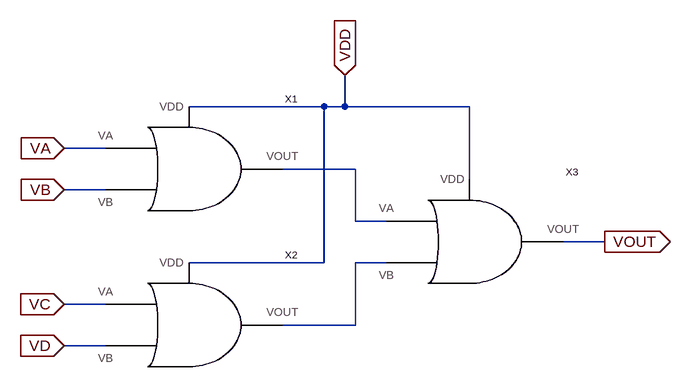
[diagram p0: schematic or4.asc]
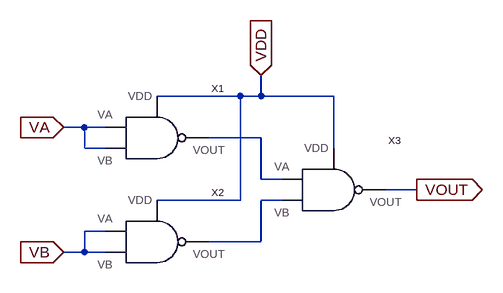
[diagram p1: sub-circuit or.asc]
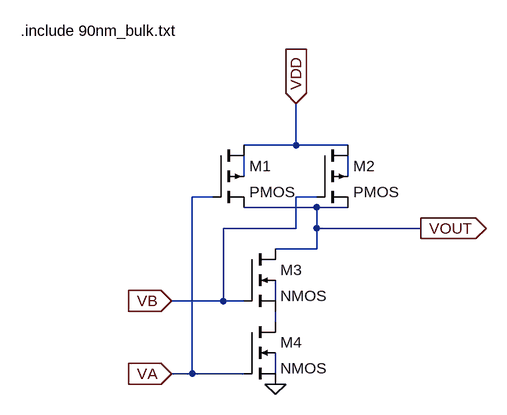
[diagram p2: sub-circuit nand.asc]
or4.asc, the LTspice schematic file:
Version 4
SHEET 1 1196 680
WIRE 320 -112 112 -112
WIRE 352 -112 352 -160
WIRE 352 -112 320 -112
WIRE 544 -112 352 -112
WIRE -16 -48 -80 -48
WIRE 368 -16 256 -16
WIRE 544 0 544 -112
WIRE -16 16 -80 16
WIRE 368 64 368 -16
WIRE 416 64 368 64
WIRE 752 96 688 96
WIRE 320 128 320 -112
WIRE 320 128 112 128
WIRE 416 128 368 128
WIRE -16 192 -80 192
WIRE 368 224 368 128
WIRE 368 224 256 224
WIRE -16 256 -80 256
FLAG 352 -160 VDD
IOPIN 352 -160 In
FLAG -80 -48 VA
IOPIN -80 -48 In
FLAG -80 16 VB
IOPIN -80 16 In
FLAG -80 192 VC
IOPIN -80 192 In
FLAG -80 256 VD
IOPIN -80 256 In
FLAG 752 96 VOUT
IOPIN 752 96 Out
SYMBOL or 96 -16 R0
SYMATTR InstName X1
SYMBOL or 96 224 R0
SYMATTR InstName X2
SYMBOL or 528 96 R0
SYMATTR InstName X3

or.asc, the sub-circuit schematic file:
Version 4
SHEET 1 880 680
WIRE 240 48 112 48
WIRE 272 48 272 16
WIRE 272 48 240 48
WIRE 384 48 272 48
WIRE 0 96 -32 96
WIRE 32 96 0 96
WIRE 272 112 192 112
WIRE 0 128 0 96
WIRE 32 128 0 128
WIRE 384 128 384 48
WIRE 272 176 272 112
WIRE 304 176 272 176
WIRE 512 192 464 192
WIRE 240 208 240 48
WIRE 240 208 112 208
WIRE 304 208 272 208
WIRE 32 256 0 256
WIRE 272 272 272 208
WIRE 272 272 192 272
WIRE 0 288 0 256
WIRE 0 288 -32 288
WIRE 32 288 0 288
FLAG 272 16 VDD
IOPIN 272 16 In
FLAG -32 96 VA
IOPIN -32 96 In
FLAG -32 288 VB
IOPIN -32 288 In
FLAG 512 192 VOUT
IOPIN 512 192 Out
SYMBOL nand 96 96 R0
SYMATTR InstName X1
SYMBOL nand 96 256 R0
SYMATTR InstName X2
SYMBOL nand 368 176 R0
SYMATTR InstName X3

nand.asc, the sub-circuit schematic file:
Version 4
SHEET 1 880 696
WIRE 496 272 496 208
WIRE 496 272 416 272
WIRE 576 272 496 272
WIRE 416 320 416 288
WIRE 576 320 576 288
WIRE 368 352 336 352
WIRE 528 352 496 352
WIRE 528 368 416 368
WIRE 576 368 528 368
WIRE 496 400 496 352
WIRE 496 400 384 400
WIRE 528 400 528 368
WIRE 688 400 528 400
WIRE 528 432 528 400
WIRE 528 432 464 432
WIRE 384 512 384 400
WIRE 384 512 304 512
WIRE 416 512 384 512
WIRE 464 512 464 480
WIRE 464 544 464 528
WIRE 336 624 336 352
WIRE 336 624 304 624
WIRE 416 624 336 624
WIRE 464 624 464 592
FLAG 304 624 VA
IOPIN 304 624 In
FLAG 304 512 VB
IOPIN 304 512 In
FLAG 496 208 VDD
IOPIN 496 208 In
FLAG 688 400 VOUT
IOPIN 688 400 Out
FLAG 464 640 0
SYMBOL nmos4 416 432 R0
SYMATTR InstName M3
SYMATTR Value2 l=90n w=200n
SYMBOL nmos4 416 544 R0
SYMATTR InstName M4
SYMATTR Value2 l=90n w=200n
SYMBOL pmos4 368 272 R0
SYMATTR InstName M1
SYMATTR Value2 l=90n w=400n
SYMBOL pmos4 528 272 R0
SYMATTR InstName M2
SYMATTR Value2 l=90n w=400n
TEXT 72 96 Left 2 !.include 90nm_bulk.txt

The netlist it stands for:
* or4.asc
XX1 VA VB VDD N001 or
XX2 VC VD VDD N002 or
XX3 N001 N002 VDD VOUT or

* block symbol definitions
.subckt or VA VB VDD VOUT
XX1 VA VA VDD N001 nand
XX2 VB VB VDD N002 nand
XX3 N001 N002 VDD VOUT nand
.ends or

.subckt nand VA VB VDD VOUT
M3 VOUT VB N004 N003 NMOS l=90n w=200n
M4 N004 VA 0 N005 NMOS l=90n w=200n
M1 VDD VA VOUT N001 PMOS l=90n w=400n
M2 VDD VB VOUT N002 PMOS l=90n w=400n
.include 90nm_bulk.txt
.ends nand

.model NMOS NMOS
.model PMOS PMOS
.lib standard.mos
.backanno
.end